# EAGLE design Gateway_Mega_Shield_v0.1 (EAGLE 9.4.2)
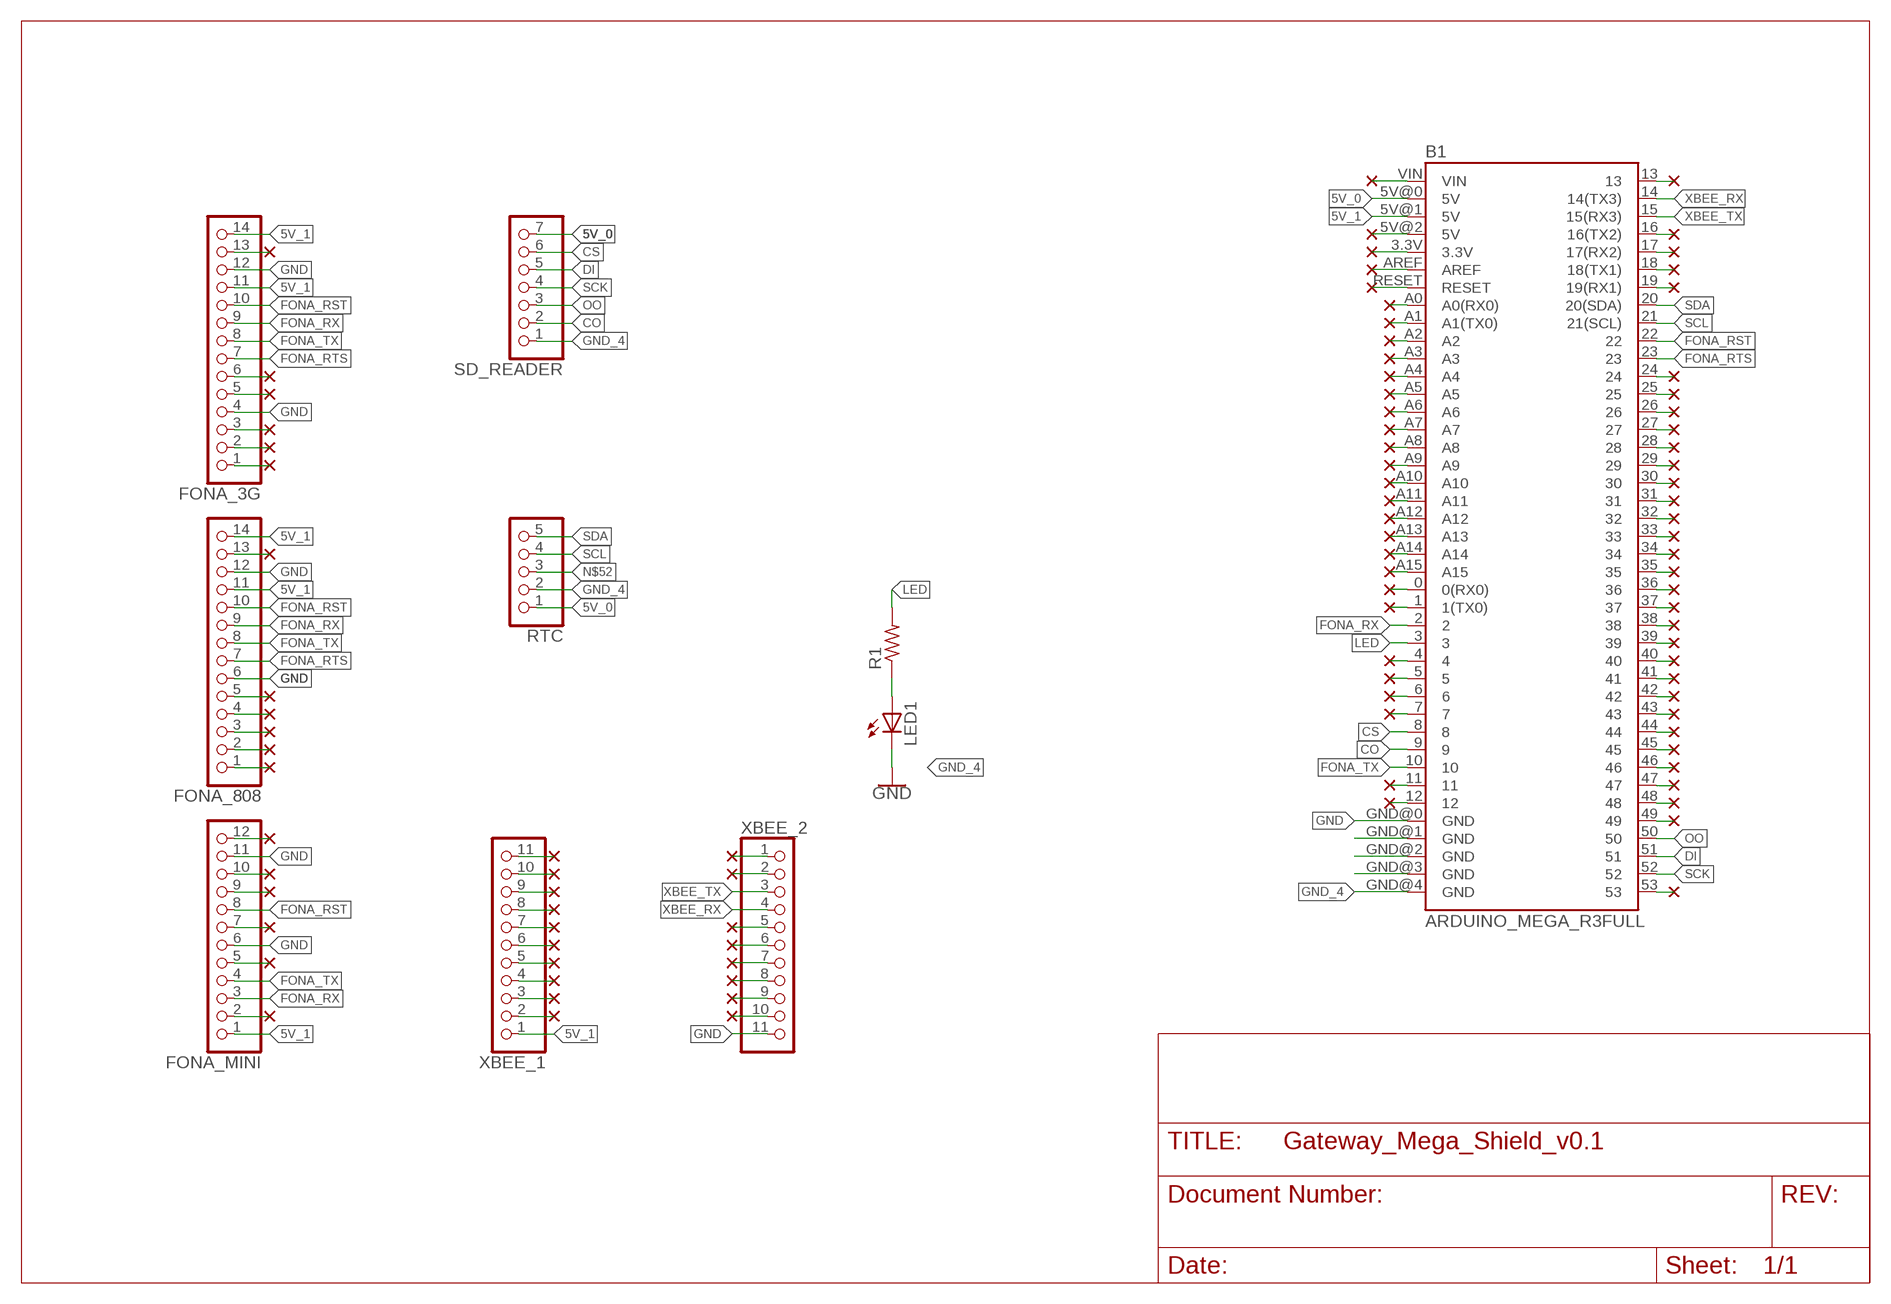
[diagram p0: schematic, sheet 1]

## Parts
B1  ARDUINO_MEGA_R3FULL  [ARDUINO_MEGA]
FONA_3G  PINHD-1X14  [1X14]
FONA_808  PINHD-1X14  [1X14]
FONA_MINI  PINHD-1X12  [1X12]
LED1  LED5MM  [LED5MM]
R1  R-US_0207/10  [0207/10]
RTC  PINHD-1X5  [1X05]
SD_READER  PINHD-1X7  [1X07]
XBEE_1  PINHD-1X11  [1X11]
XBEE_2  PINHD-1X11  [1X11]

## Nets
5V_0: B1.5V@0(5V) RTC.1 SD_READER.7
5V_1: B1.5V@1(5V) FONA_3G.11 FONA_3G.14 FONA_808.11 FONA_808.14 FONA_MINI.1 XBEE_1.1
CO: B1.9 SD_READER.2
CS: B1.8 SD_READER.6
DI: B1.51 SD_READER.5
FONA_RST: B1.22 FONA_3G.10 FONA_808.10 FONA_MINI.8
FONA_RTS: B1.23 FONA_3G.7 FONA_808.7
FONA_RX: B1.2 FONA_3G.9 FONA_808.9 FONA_MINI.3
FONA_TX: B1.10 FONA_3G.8 FONA_808.8 FONA_MINI.4
GND: B1.GND@0(GND) FONA_3G.4 FONA_3G.12 FONA_808.6 FONA_808.12 FONA_MINI.6 FONA_MINI.11 XBEE_2.11
GND_4: B1.GND@4(GND) LED1.K(C) RTC.2 SD_READER.1 ; supply symbol labelled GND
LED: B1.3 R1.2
N$1: LED1.A R1.1
N$2: B1.13
N$3: B1.GND@2(GND)
N$4: FONA_3G.13
N$5: B1.GND@3(GND)
N$6: B1.5V@2(5V)
N$7: XBEE_2.1
N$8: B1.GND@1(GND)
N$11: FONA_3G.6
N$12: FONA_3G.5
N$14: FONA_3G.3
N$15: FONA_3G.2
N$16: FONA_3G.1
N$18: FONA_808.13
N$26: FONA_808.5
N$27: FONA_808.4
N$28: FONA_808.3
N$29: FONA_808.2
N$30: FONA_808.1
N$31: FONA_MINI.12
N$33: FONA_MINI.10
N$34: FONA_MINI.9
N$36: FONA_MINI.7
N$38: FONA_MINI.5
N$41: FONA_MINI.2
N$52: RTC.3
N$57: B1.16(16(TX2))
N$58: B1.17(17(RX2))
N$59: B1.18(18(TX1))
N$60: B1.19(19(RX1))
N$65: B1.24
N$66: B1.25
N$67: B1.26
N$68: B1.27
N$69: B1.28
N$70: B1.29
N$71: B1.30
N$72: B1.31
N$73: B1.32
N$74: B1.33
N$75: B1.34
N$76: B1.35
N$77: B1.36
N$78: B1.37
N$79: B1.38
N$80: B1.39
N$81: B1.40
N$82: B1.41
N$83: B1.42
N$84: B1.43
N$85: B1.44
N$86: B1.45
N$87: B1.46
N$88: B1.47
N$89: B1.48
N$90: B1.49
N$94: B1.53
N$100: B1.12
N$101: B1.11
N$105: B1.7
N$106: B1.6
N$107: B1.5
N$108: B1.4
N$109: XBEE_1.11
N$111: B1.1(1(TX0))
N$112: B1.0(0(RX0))
N$113: B1.A15
N$114: B1.A14
N$115: B1.A13
N$116: B1.A12
N$117: B1.A11
N$118: B1.A10
N$119: B1.VIN
N$123: B1.3.3V
N$124: B1.AREF
N$125: B1.RESET
N$126: B1.A0(A0(RX0))
N$127: B1.A1(A1(TX0))
N$128: B1.A2
N$129: B1.A3
N$130: B1.A4
N$131: B1.A9
N$132: B1.A8
N$133: B1.A7
N$134: B1.A6
N$135: B1.A5
N$136: XBEE_1.10
N$137: XBEE_1.9
N$138: XBEE_1.8
N$139: XBEE_1.7
N$140: XBEE_1.6
N$141: XBEE_1.5
N$142: XBEE_1.4
N$143: XBEE_1.3
N$144: XBEE_1.2
N$147: XBEE_2.2
N$150: XBEE_2.5
N$151: XBEE_2.6
N$152: XBEE_2.7
N$153: XBEE_2.8
N$154: XBEE_2.9
N$155: XBEE_2.10
OO: B1.50 SD_READER.3
SCK: B1.52 SD_READER.4
SCL: B1.21(21(SCL)) RTC.4
SDA: B1.20(20(SDA)) RTC.5
XBEE_RX: B1.14(14(TX3)) XBEE_2.4
XBEE_TX: B1.15(15(RX3)) XBEE_2.3

## Library data of the parts
B1 = SparkFun-Boards:ARDUINO_MEGA_R3: Arduino Mega R3 ATmega2560 R3 compatible footprint. SparkFun Products: Arduino Mega 2560 R3 <https://www.sparkfun.com/products/11061>
FONA_3G FONA_808 = pinhead:PINHD-1X14: PIN HEADER
FONA_MINI = pinhead:PINHD-1X12: PIN HEADER
LED1 = adafruit:LED: LED OSRAM: - CHIPLED LG R971, LG N971, LY N971, LG Q971, LY Q971, LO R971, LY R971 LH N974, LH R974 LS Q976, LO Q976, LY Q976 LO Q996 - Hyper CHIPLED LW Q18S LB Q993, LB Q99A, LB R99A - SideLED LS A670, LO A670, LY A670, LG A670, LP A670 LB A673, LV A673, LT A673, LW A673 LH A674 LY A675 LS A676, LA A676, LO A676, LY A676, LW A676 LS A679, LY A679, LG A679 - Hyper Micro SIDELED® LS Y876, LA Y876, LO Y876, LY Y876 LT Y87S - SmartLED LW L88C, LW L88S LB L89C, LB L89S, LG L890 LS L89K, LO L89K, LY L89K LS L896, LA L896, LO L896, LY L896 - TOPLED LS T670, LO T670, LY T670, LG T670, LP T670 LSG T670, LSP T670, LSY T670, LOP T670, LYG T670 LG T671, LOG T671, LSG T671 LB T673, LV T673, LT T673, LW T673 LH T674 LS T676, LA T676, LO T676, LY T676, LB T676, LH T676, LSB T676, LW T676 LB T67C, LV T67C, LT T67C, LS T67K, LO T67K, LY T67K, LW E67C LS E67B, LA E67B, LO E67B, LY E67B, LB E67C, LV E67C, LT E67C LW T67C LS T679, LY T679, LG T679 LS T770, LO T770, LY T770, LG T770, LP T770 LB T773, LV T773, LT T773, LW T773 LH T774 LS E675, LA E675, LY E675, LS T675 LS T776, LA T776, LO T776, LY T776, LB T776 LHGB T686 LT T68C, LB T68C - Hyper Mini TOPLED® LB M676 - Mini TOPLED Santana® LG M470 LS M47K, LO M47K, LY M47K Source: http://www.osram.convergy.de/
R1 = adafruit:R-US_: RESISTOR, American symbol
RTC = pinhead:PINHD-1X5: PIN HEADER
SD_READER = pinhead:PINHD-1X7: PIN HEADER
XBEE_1 XBEE_2 = pinhead:PINHD-1X11: PIN HEADER

## Board
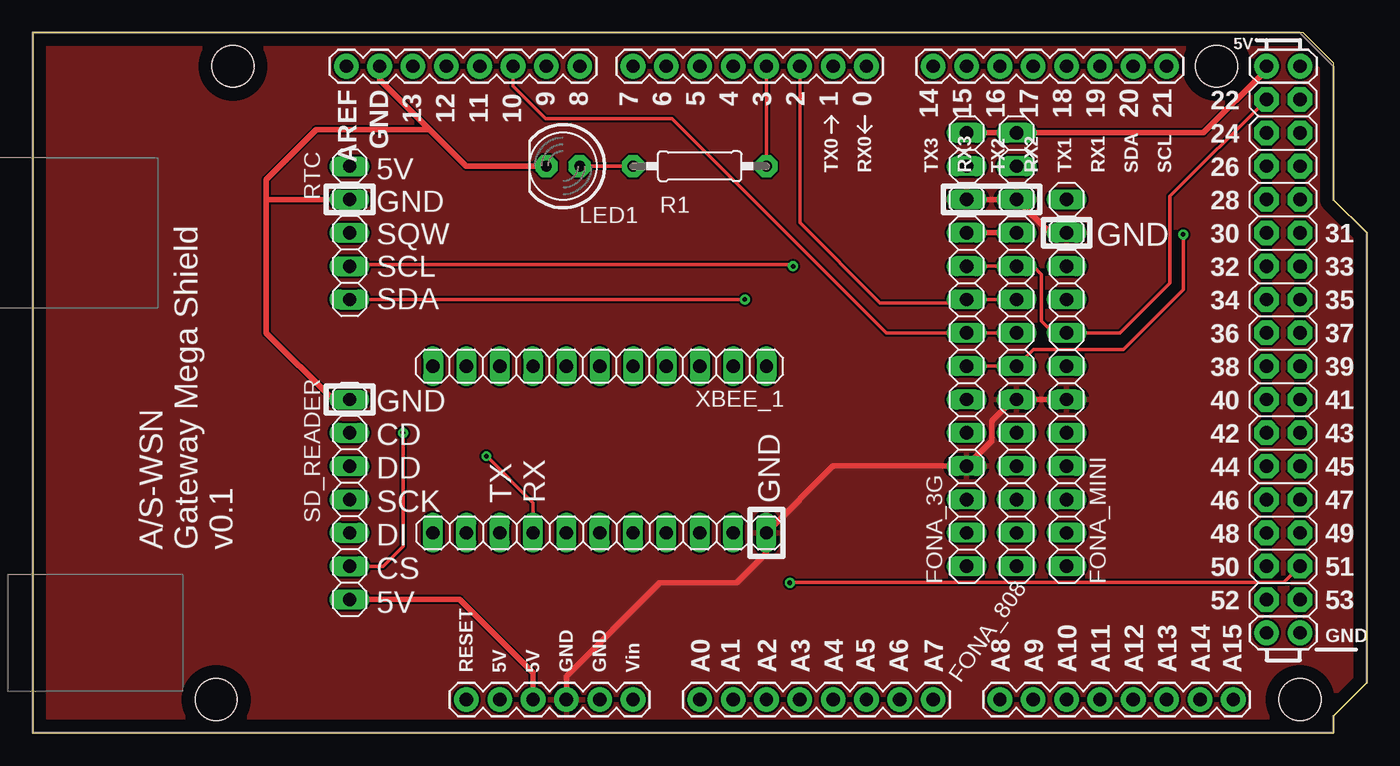
[diagram p1: board, top side]
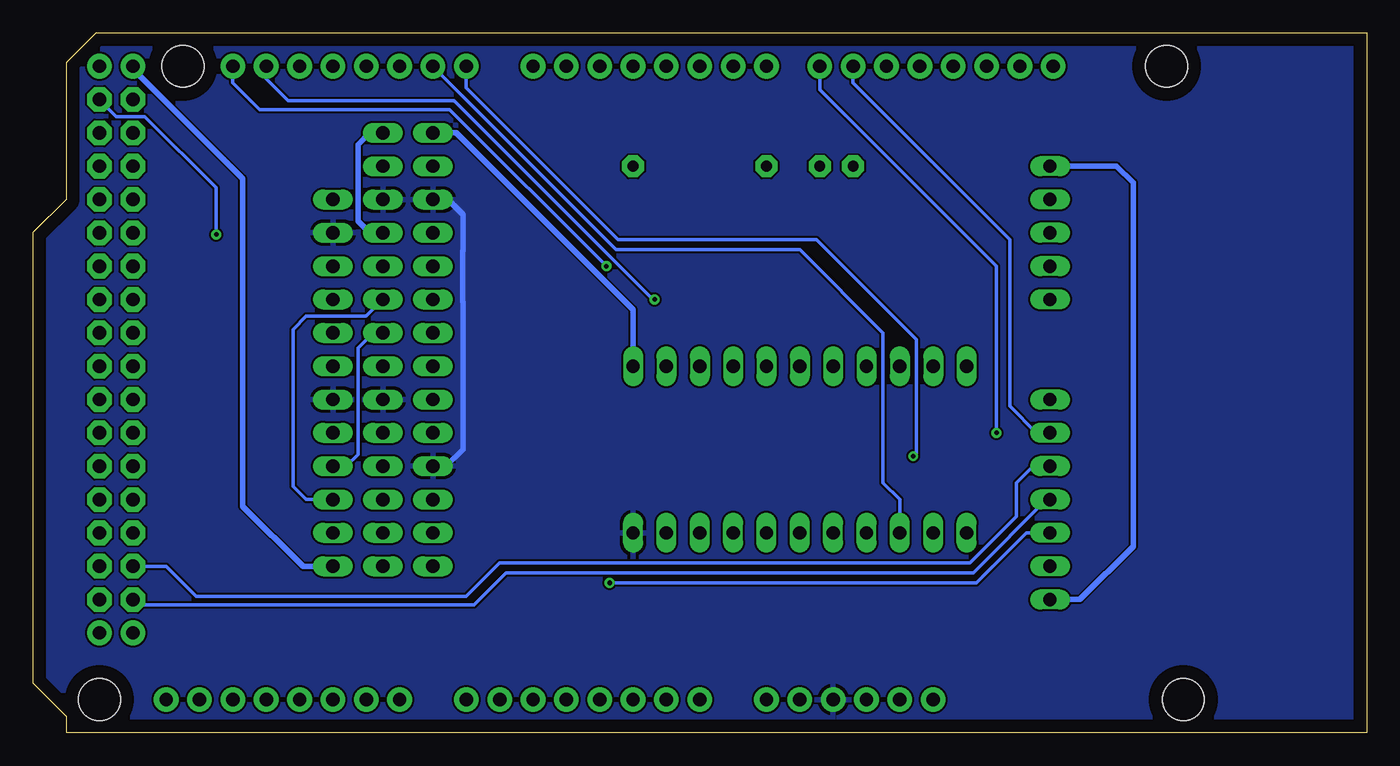
[diagram p2: board, bottom side, seen from below]

Size 101.6 x 53.34 mm. Coordinates in mm from the lower left corner, seen from the top.
Outline: 0,0 99.06,0 99.06,1.27 101.6,3.81 101.6,38.1 99.06,40.64 99.06,51.05 96.77,53.34 0,53.34 0,0
Copper layers (1*16): Top 0.035mm / dielectric 1.5mm / Bottom 0.035mm
Design rules "default": minimum track width 6mil, minimum drill 0.35mm, track to track 6mil, track to pad 6mil, pad to pad 6mil, via to via 6mil, smd to smd 6mil, copper to edge 40mil, drill to drill 6mil, minimum pad ring 10mil, minimum via ring 8mil, stop-mask expansion 4mil, vias tented up to drill 0mil, thermal gap 10mil

### Footprints (pad centres in the part's own frame; a part is rotated, then mirrored left to right if it is on the bottom)
ARDUINO_MEGA_SPARKFUN_MODIFIED = drill 1.016 pad 1.88: 0 13.97,24.13; 1 11.43,24.13; 2 8.89,24.13; 3 6.35,24.13; 3.3V -13.97,-24.13; 4 3.81,24.13; 5 1.27,24.13; 5V@0 -11.43,-24.13; 5V@1 44.45,24.13; 5V@2 46.99,24.13; 6 -1.27,24.13; 7 -3.81,24.13; 8 -7.874,24.13; 9 -10.414,24.13; 10 -12.954,24.13; 11 -15.494,24.13; 12 -18.034,24.13; 13 -20.574,24.13; 14 19.05,24.13; 15 21.59,24.13; 16 24.13,24.13; 17 26.67,24.13; 18 29.21,24.13; 19 31.75,24.13; 20 34.29,24.13; 21 36.83,24.13; A0 1.27,-24.13; A1 3.81,-24.13; A2 6.35,-24.13; A3 8.89,-24.13; A4 11.43,-24.13; A5 13.97,-24.13; A6 16.51,-24.13; A7 19.05,-24.13; A8 24.13,-24.13; A9 26.67,-24.13; A10 29.21,-24.13; A11 31.75,-24.13; A12 34.29,-24.13; A13 36.83,-24.13; A14 39.37,-24.13; A15 41.91,-24.13; AREF -25.654,24.13; GND@0 -8.89,-24.13; GND@1 -6.35,-24.13; GND@2 44.45,-19.05; GND@3 46.99,-19.05; GND@4 -23.114,24.13; RESET -16.51,-24.13; VIN -3.81,-24.13 | drill 1.016 pad 1.88 octagon: 22 44.45,21.59; 23 46.99,21.59; 24 44.45,19.05; 25 46.99,19.05; 26 44.45,16.51; 27 46.99,16.51; 28 44.45,13.97; 29 46.99,13.97; 30 44.45,11.43; 31 46.99,11.43; 32 44.45,8.89; 33 46.99,8.89; 34 44.45,6.35; 35 46.99,6.35; 36 44.45,3.81; 37 46.99,3.81; 38 44.45,1.27; 39 46.99,1.27; 40 44.45,-1.27; 41 46.99,-1.27; 42 44.45,-3.81; 43 46.99,-3.81; 44 44.45,-6.35; 45 46.99,-6.35; 46 44.45,-8.89; 47 46.99,-8.89; 48 44.45,-11.43; 49 46.99,-11.43; 50 44.45,-13.97; 51 46.99,-13.97; 52 44.45,-16.51; 53 46.99,-16.51 | hole 3.2: -34.29,24.13; -35.56,-24.13; 40.64,24.13; 46.99,-24.13
1X14 = drill 1.016 long: 1 -16.51,0; 2 -13.97,0; 3 -11.43,0; 4 -8.89,0; 5 -6.35,0; 6 -3.81,0; 7 -1.27,0; 8 1.27,0; 9 3.81,0; 10 6.35,0; 11 8.89,0; 12 11.43,0; 13 13.97,0; 14 16.51,0
1X12 = drill 1.016 long: 1 -13.97,0; 2 -11.43,0; 3 -8.89,0; 4 -6.35,0; 5 -3.81,0; 6 -1.27,0; 7 1.27,0; 8 3.81,0; 9 6.35,0; 10 8.89,0; 11 11.43,0; 12 13.97,0
LED5MM = drill 0.813 pad 1.676 octagon: A -1.27,0; K 1.27,0
0207/10 = drill 0.813 pad 1.676 octagon: 1 -5.08,0; 2 5.08,0
1X05 = drill 1.016 long: 1 -5.08,0; 2 -2.54,0; 3 0,0; 4 2.54,0; 5 5.08,0
1X07 = drill 1.016 long: 1 -7.62,0; 2 -5.08,0; 3 -2.54,0; 4 0,0; 5 2.54,0; 6 5.08,0; 7 7.62,0
1X11 = drill 1.016 long: 1 -12.7,0; 2 -10.16,0; 3 -7.62,0; 4 -5.08,0; 5 -2.54,0; 6 0,0; 7 2.54,0; 8 5.08,0; 9 7.62,0; 10 10.16,0; 11 12.7,0

### Placement (x,y rotation side)
B1  ARDUINO_MEGA_R3_SPARKFUN_MODIFIEDFULL  [ARDUINO_MEGA_SPARKFUN_MODIFIED]  49.53,26.67 0 top
FONA_3G  71.12,29.21 90 top
FONA_808  74.93,29.21 90 top
FONA_MINI  78.74,26.67 90 top
LED1  40.39,43.18 180 top
R1  50.8,43.18 0 top
RTC  24.13,38.1 270 top
SD_READER  24.13,17.78 270 top
XBEE_1  43.18,27.94 180 top
XBEE_2  43.18,15.24 0 top

### Tracks (layer width: path | path; a pad name or v marks a point on that pad's centre or on a via)
5V_0
  Top 0.406: B1.5V@0 38.1,4.57 32.51,10.16 SD_READER.7
  Bottom 0.406: RTC.1 19.05,43.18 17.78,41.91 17.78,14.22 21.84,10.16 SD_READER.7
5V_1
  Top 0.406: FONA_3G.14 FONA_808.14 89.15,45.72 93.98,50.55 B1.5V@1 | FONA_3G.11 FONA_808.11
  Bottom 0.406: XBEE_1.1 55.88,32.26 69.34,45.72 FONA_3G.14 | B1.5V@1 93.98,50.62 85.6,42.24 85.6,17.27 81.03,12.7 FONA_MINI.1 | FONA_808.14 75.95,45.72 76.83,44.83 76.83,38.99 75.95,38.1 FONA_808.11
CO
  Bottom 0.254: SD_READER.2 25.15,22.86 27.18,24.89 27.18,37.59 39.12,49.53 B1.9
CS  (via drill 0.35)
  Top 0.254: SD_READER.6 26.67,12.7 28.19,14.22 v28.19,22.86
  Bottom 0.254: v28.19,22.86 28.19,35.56 41.66,49.02 B1.8
DI  (via drill 0.35)
  Top 0.254: B1.51 95.28,11.46 57.68,11.46 v57.66,11.43
  Bottom 0.254: v57.66,11.43 29.72,11.43 25.91,15.24 SD_READER.5
FONA_RST
  Top 0.254: FONA_3G.10 FONA_808.10 76.2,35.56 76.83,34.92 76.83,31.37 77.72,30.48 FONA_MINI.8 82.8,30.48 86.61,34.29 86.61,40.89 B1.22
FONA_RTS  (via drill 0.35)
  Top 0.254: FONA_3G.7 FONA_808.7 76.2,29.21 83.06,29.21 87.63,33.78 v87.63,37.97
  Bottom 0.152: 96.52,48.23 B1.23
  Bottom 0.254: v87.63,37.97 87.63,41.53 93.06,46.97 95.25,46.97 96.52,48.23
FONA_RX
  Top 0.254: FONA_808.9 FONA_3G.9 70.87,32.77 64.52,32.77 58.42,38.86 B1.2
  Bottom 0.254: FONA_808.9 76.2,31.75 80.77,31.75 81.79,30.73 81.79,18.8 80.77,17.78 FONA_MINI.3
FONA_TX
  Top 0.254: FONA_808.8 FONA_3G.8 65.01,30.48 48.7,46.79 39.06,46.79 36.58,49.28 B1.10
  Bottom 0.254: FONA_808.8 75.69,30.48 76.83,29.34 76.83,21.21 77.72,20.32 FONA_MINI.4
GND
  Top 0.152: FONA_808.6 74.67,25.4
  Top 0.406: 74.67,25.4 73.05,23.78 73.05,22.25 FONA_3G.4 60.96,20.32 XBEE_2.11 | FONA_3G.12 FONA_808.12 77.47,38.1 FONA_MINI.11 | 55.88,14.99 XBEE_2.11 | B1.GND@0 40.64,4.32 47.75,11.43 53.59,11.43 55.88,13.72 XBEE_2.11 | FONA_808.6 FONA_MINI.6
  Bottom 0.406: FONA_3G.12 69.98,40.64 68.83,39.5 68.83,36.75 68.86,36.73 68.86,32.87 68.83,32.84 68.83,21.59 70.1,20.32 FONA_3G.4
  pour Top: -1.27,54.61 102.87,54.61 102.87,-1.27 -1.27,-1.27
  pour Bottom: -2.54,55.88 104.14,55.88 104.14,-2.54 -2.54,-2.54
GND_4
  Top 0.406: 17.78,40.64 17.78,42.16 21.59,45.97 30.23,45.97 | 17.78,40.64 17.78,30.48 22.86,25.4 SD_READER.1 | 30.23,45.97 26.42,49.78 B1.GND@4 | RTC.2 17.78,40.64 | LED1.K 33.02,43.18 30.23,45.97
LED
  Top 0.254: R1.2 B1.3
N$1
  Top 0.254: R1.1 LED1.A
OO
  Bottom 0.254: SD_READER.3 25.4,20.32 26.67,19.05 26.67,16.51 30.23,12.95 66.04,12.95 68.58,10.41 89.15,10.41 91.44,12.7 B1.50
SCK
  Bottom 0.254: B1.52 93.57,9.75 67.97,9.75 65.53,12.19 29.97,12.19 24.38,17.78 SD_READER.4
SCL  (via drill 0.35)
  Top 0.254: v57.91,35.56 57.78,35.69 24.26,35.69 RTC.4
  Bottom 0.254: B1.21 86.36,49.53 84.33,47.5 69.85,47.5 v57.91,35.56
SDA  (via drill 0.35)
  Top 0.254: RTC.5 v54.23,33.02
  Bottom 0.254: B1.20 83.82,49.84 82.17,48.18 69.52,48.18 54.36,33.02 v54.23,33.02
XBEE_RX  (via drill 0.35)
  Top 0.254: v34.54,21.08 38.1,17.53 XBEE_2.4
  Bottom 0.254: B1.14 68.58,49.15 57.02,37.59 41.91,37.59 34.29,29.97 34.29,21.34 v34.54,21.08
XBEE_TX
  Bottom 0.152: B1.15 71.12,50.75
  Bottom 0.254: 71.12,50.75 57.17,36.8 43.16,36.8 36.83,30.48 36.83,19.05 35.56,17.78 XBEE_2.3

### Text on the board
tPlace: A/S-WSN / Gateway Mega Shield / v0.1
tNames: GND | 5V / GND / SQW / SCL / SDA | TX / RX / / / / / / / GND | GND / CD / DD / SCK / DI / CS / 5V